# Altium schematic sheet Page-10.schdoc: BATT CHARGER
size 185 x 195 mm; CompanyName: InSYS; DrawnBy: NaveenKumar; Revision: 2.0; SheetNumber: 10; SheetTotal: 10; Title2: Gateway
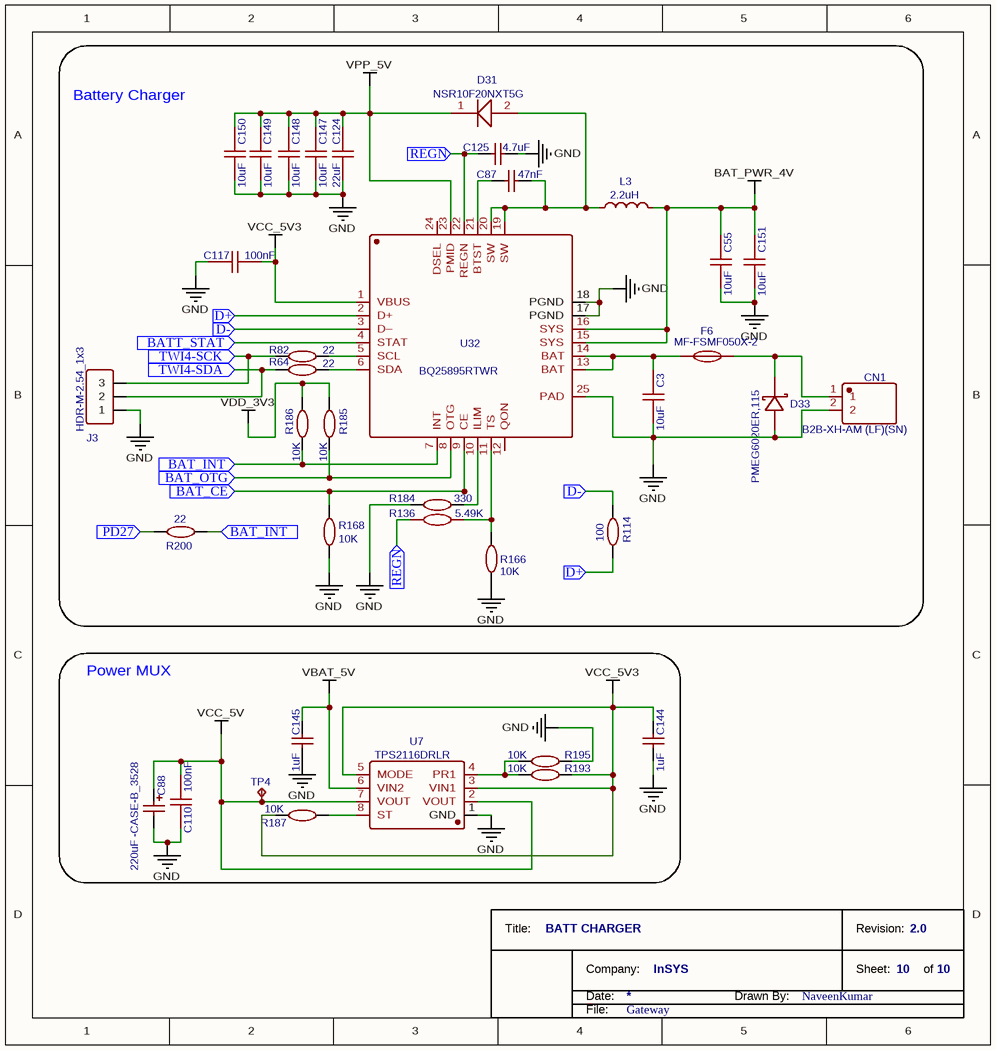
[diagram p0: Page-10.schdoc]

## Parts
*  TitleBlock_1  (value not drawn)  (graphical)
C3  10uF  [GWAY_Capacitor_0805]
C55  10uF  [GWAY_Capacitor_0805]
C87  47nF  [GWAY_Capacitor_0603]
C88  220uF -CASE-B_3528  [GWAY_CASE-B]
C110  100nF  [GWAY_Capacitor_0603]
C117  100nF  [GWAY_Capacitor_0603]
C124  22uF  [GWAY_Capacitor_0805]
C125  4.7uF  [GWAY_Capacitor_0603]
C144  1uF  [GWAY_Capacitor_0603]
C145  1uF  [GWAY_Capacitor_0603]
C147  10uF  [GWAY_Capacitor_0805]
C148  10uF  [GWAY_Capacitor_0805]
C149  10uF  [GWAY_Capacitor_0805]
C150  10uF  [GWAY_Capacitor_0805]
C151  10uF  [GWAY_Capacitor_0805]
CN1  B2B-XH-AM (LF)(SN)  [GWAY_B2P-VH-LF-SN]
D31  NSR10F20NXT5G  [GWAY_DSN2_0502]
D33  PMEG6020ER,115  [GWAY_SOD123F]
F6  MF-FSMF050X-2  [GWAY_FUSE0805]
J3  HDR-M-2.54_1x3  [GWAY_3Way_Header_Conn]
L3  2.2uH  [GWAY_INDUCTOR_6_5X6_5X3]
R64  22  [GWAY_Resistor_0603]
R82  22  [GWAY_Resistor_0603]
R114  100  [GWAY_Resistor_0603]
R136  5.49K  [GWAY_Resistor_0603]
R166  10K  [GWAY_Resistor_0603]
R168  10K  [GWAY_Resistor_0603]
R184  330  [GWAY_Resistor_0603]
R185  10K  [GWAY_Resistor_0603]
R186  10K  [GWAY_Resistor_0603]
R187  10K  [GWAY_Resistor_0603]
R193  10K  [GWAY_Resistor_0603]
R195  10K  [GWAY_Resistor_0603]
R200  22  [GWAY_Resistor_0603]
TP4  TP-052-TJ  [GWAY_TESTPOINT1]  (value not drawn)
U7  TPS2116DRLR  [GWAY_SOT_583_8PIN]
U32  BQ25895RTWR  [GWAY_QFN_24PIN_4X4X1-25N]

## Blocks framed on the sheet
Battery Charger: C3 C55 C87 C117 C124 C125 C147-C151 CN1 D31 D33 F6 J3 L3 R64 R82 R114 R136 R166 R168 R184-R186 R200 U32
Power MUX: C88 C110 C144 C145 R187 R193 R195 TP4 U7

## Ports
BAT_CE (in), BAT_INT (in), BAT_OTG (in), BATT_STAT (in), D+ (in), D- (in), PD27 (in), REGN (in), TWI4-SCK (in), TWI4-SDA (in)

## Nets
BAT_PWR_4V: C55.2 C151.2 L3.2 U32.15(SYS) U32.16(SYS)
GND: C3.1 C55.1 C88.2 C110.2 C117.1 C124.2 C125.1 C144.2 C145.2 C147.1 C148.1 C149.1 C150.1 C151.1 CN1.2 D33.2(A) J3.1 R166.2 R168.1 R184.1 R195.1 U7.1(GND) U32.17(PGND) U32.18(PGND) U32.25(PAD)
VBAT_5V: C145.1 U7.6(VIN2)
VCC_5V: C88.1 C110.1 TP4.1 U7.2(VOUT) U7.7(VOUT)
VCC_5V3: C117.2 C144.1 R187.2 R193.1 U7.3(VIN1) U7.5(MODE) U32.1(VBUS)
VDD_3V3: R185.1 R186.1
VPP_5V: C124.1 C147.2 C148.2 C149.2 C150.2 D31.1(K) U32.23(PMID)
BAT_CE: R168.2 U32.9(CE) ; port BAT_CE
BAT_INT: R186.2 R200.2 U32.7(INT) ; port BAT_INT
BAT_OTG: R185.2 U32.8(OTG) ; port BAT_OTG
BATT_STAT: U32.4(STAT) ; port BATT_STAT
D+: R114.1 U32.2(D+) ; port D+
D-: R114.2 U32.3(D–) ; port D-
PD27: R200.1 ; port PD27
REGN: C125.2 R136.1 U32.22(REGN) ; port REGN
TWI4-SCK: J3.3 R82.1 ; port TWI4-SCK
TWI4-SDA: J3.2 R64.1 ; port TWI4-SDA
NetC3_2: C3.2 F6.1 U32.13(BAT) U32.14(BAT)
NetC87_1: C87.1 U32.21(BTST)
NetC87_2: C87.2 D31.2(A) L3.1 U32.19(SW) U32.20(SW)
NetCN1_1: CN1.1 D33.1(C) F6.2
NetR64_2: R64.2 U32.6(SDA)
NetR82_2: R82.2 U32.5(SCL)
NetR136_2: R136.2 R166.1 U32.11(TS)
NetR184_2: R184.2 U32.10(ILIM)
NetR187_1: R187.1 U7.8(ST)
NetR193_2: R193.2 R195.2 U7.4(PR1)

Not connected (* = marked no-connect by the designer): U32 12(QON) 24(DSEL)

## Notes on the sheet
- (in symbol TitleBlock_1) Title:; Revision:; Company:; Sheet:; of; Date:; Drawn By:; File:

## Library data of the parts
* = TitleBlock_1: TitleBlock  No-2; TitleName: *; Company: *; Drawn By: *; File: *
C3 C55 C147-C151 = 10uF: Manufacturer: SAMSUNG(三星); Manufacturer Part: CL21B106KOQNNNE; nameAlias: Capacitance; Supplier: LCSC; Supplier Part: C95841; JLCPCB Part Class: Extended Part; spicePre: C; spiceSymbolName: CL21B106KOQNNNE
C87 = 47nF: Manufacturer Part: CL10B473KB8NNNC; Manufacturer: SAMSUNG; nameAlias: Capacitance; SMT Type: Basic; Supplier: LCSC; LCSC Assembly: Yes; Supplier Part: C1622; spicePre: C; spiceSymbolName: CL10B473KB8NNNC
C88 = 220uF -CASE-B_3528: Manufacturer: PANASONIC; Manufacturer Part: 6TPE220MAZB; nameAlias: Capacitance; SMT Type: Extend; Supplier: LCSC; Supplier Part: C79111; LCSC Assembly: Yes; spicePre: C; spiceSymbolName: 6TPE220MAZB
C110 C117 = 100nF: Manufacturer: SAMSUNG; Manufacturer Part: CL10B104KB8NNNC; nameAlias: Capacitance; Supplier: LCSC; Supplier Part: C1591; spicePre: C; spiceSymbolName: CL10B104KB8NNNC
C124 = 22uF: Manufacturer: TAIYO YUDEN; Manufacturer Part: LMK212BJ226MG-T; nameAlias: Capacitance; Supplier: LCSC; Supplier Part: C92814; spicePre: C; spiceSymbolName: LMK212BJ226MG-T
C125 = 4.7uF: Manufacturer Part: CL10A475KQ8NNNC; Manufacturer: SAMSUNG; nameAlias: Capacitance; Supplier: LCSC; Supplier Part: C8032; spicePre: C; spiceSymbolName: CL10A475KQ8NNNC
C144 C145 = 1uF: Manufacturer Part: CL10B105KA8NNNC; Manufacturer: SAMSUNG(三星); nameAlias: Capacitance; Supplier: LCSC; Supplier Part: C29936; JLCPCB Part Class: Extended Part; spicePre: C; spiceSymbolName: CL10B105KA8NNNC
CN1 = B2B-XH-AM (LF)(SN): Manufacturer: JST; Contributor: LCSC; Supplier: LCSC; Supplier Part: C161869; Manufacturer Part: B2B-XH-AM(LF)(SN); JLCPCB Part Class: Extended Part; link: https://lcsc.com/eda_search?q=C161869&%26type=1&ref=editor; spicePre: C; spiceSymbolName: B2B-XH-AM (LF)(SN)
D33 = PMEG6020ER,115: Manufacturer: Nexperia; Contributor: LCSC; SMT Type: Extend; Supplier: LCSC; Supplier Part: C98663; Manufacturer Part: PMEG6020ER,115; LCSC Assembly: Yes; spicePre: D; spiceSymbolName: PMEG6020ER,115
F6 = MF-FSMF050X-2: Manufacturer: BOURNS; Contributor: LCSC; Supplier: LCSC; Supplier Part: C210357; Manufacturer Part: MF-FSMF050X-2; spicePre: F; spiceSymbolName: MF-FSMF050X-2
J3 = HDR-M-2.54_1x3: Contributor: LCEDA_Lib; Supplier Part: C180248; Supplier: LCSC; spicePre: J; spiceSymbolName: HDR-M-2.54_1x3
L3 = 2.2uH: Manufacturer: VISHAY(威世); Manufacturer Part: IHLP2525CZER2R2M01; nameAlias: Value; Contributor: LCSC; Supplier: LCSC; Supplier Part: C540967; JLCPCB Part Class: Extended Part; link: https://lcsc.com/eda_search?q=C540967&%26type=1&ref=editor; spicePre: L; spiceSymbolName: IHLP2525CZER2R2M01
R64 R82 R200 = 22: Manufacturer: YAGEO; Manufacturer Part: RC0603FR-0722RL; nameAlias: Resistance (Ohms); Supplier: LCSC; Supplier Part: C107701; spicePre: R; spiceSymbolName: RC0603FR-0722RL
R114 = 100: Manufacturer: YAGEO; Manufacturer Part: RC0603FR-07100RL; nameAlias: Resistance (Ohms); Supplier: LCSC; Supplier Part: C105588; spicePre: R; spiceSymbolName: RC0603FR-07100RL
R136 = 5.49K: Manufacturer: YAGEO; Manufacturer Part: RC0603FR-075K49L; nameAlias: Resistance (Ohms); Contributor: LCSC; Supplier: LCSC; Supplier Part: C188263; spicePre: R; spiceSymbolName: RC0603FR-075K49L
R166 R168 R185-R187 R193 R195 = 10K: Manufacturer: YAGEO; Manufacturer Part: RC0603JR-0710KL; nameAlias: Resistance (Ohms); Supplier: LCSC; Supplier Part: C99198; spicePre: R; spiceSymbolName: RC0603JR-0710KL
R184 = 330: Manufacturer: YAGEO; Manufacturer Part: RC0603FR-07330RL; nameAlias: Resistance (Ohms); Supplier: LCSC; Supplier Part: C105881; spicePre: R; spiceSymbolName: RC0603FR-07330RL
U7 = TPS2116DRLR: Manufacturer: TI(德州仪器); Contributor: lcsc; Supplier: LCSC; Supplier Part: C3235557; Manufacturer Part: TPS2116DRLR; JLCPCB Part Class: Extended Part; link: https://lcsc.com/eda_search?q=C3235557&%26type=1&ref=editor; spicePre: U; spiceSymbolName: TPS2116DRLR
U32 = BQ25895RTWR: Manufacturer: TI; Contributor: LCSC; SMT Type: Extend; Supplier: LCSC; Manufacturer Part: BQ25895RTWR; Supplier Part: C80200; JLCPCB SMD: Yes; spicePre: U; spiceSymbolName: BQ25895RTWR
D31 = NSR10F20NXT5G: spicePre: D; spiceSymbolName: NSR10F20NXT5G
TP4 = TP-052-TJ: Manufacturer Part: ?; spicePre: T